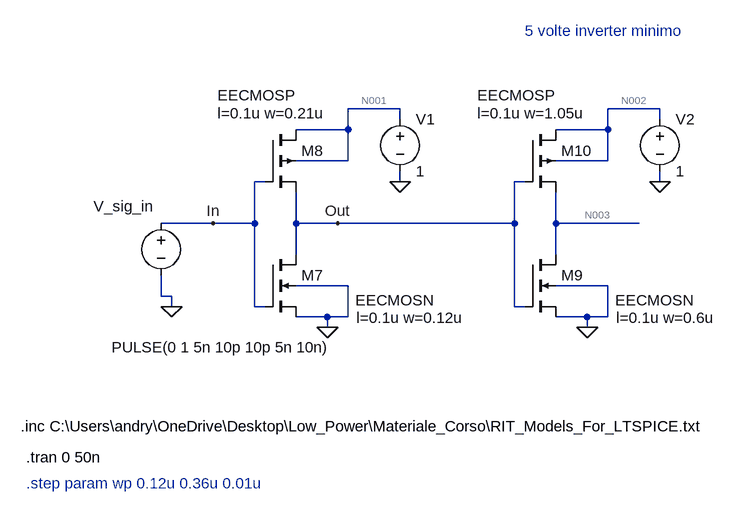
[diagram p0: schematic Esercitazione_3.asc]
Esercitazione_3.asc, the LTspice schematic file:
Version 4
SHEET 1 2808 680
WIRE 528 -96 448 -96
WIRE 928 -96 848 -96
WIRE 528 -80 528 -96
WIRE 928 -80 928 -96
WIRE 448 -64 448 -96
WIRE 448 -64 368 -64
WIRE 848 -64 848 -96
WIRE 848 -64 768 -64
WIRE 448 -16 448 -64
WIRE 448 -16 368 -16
WIRE 848 -16 848 -64
WIRE 848 -16 768 -16
WIRE 320 16 304 16
WIRE 528 16 528 0
WIRE 720 16 704 16
WIRE 928 16 928 0
WIRE 240 80 160 80
WIRE 304 80 304 16
WIRE 304 80 240 80
WIRE 368 80 368 32
WIRE 432 80 368 80
WIRE 704 80 704 16
WIRE 704 80 432 80
WIRE 768 80 768 32
WIRE 896 80 768 80
WIRE 368 128 368 80
WIRE 768 128 768 80
WIRE 448 176 368 176
WIRE 848 176 768 176
WIRE 160 192 160 160
WIRE 176 192 160 192
WIRE 176 208 176 192
WIRE 304 208 304 80
WIRE 320 208 304 208
WIRE 704 208 704 80
WIRE 720 208 704 208
WIRE 416 224 368 224
WIRE 448 224 448 176
WIRE 448 224 416 224
WIRE 816 224 768 224
WIRE 848 224 848 176
WIRE 848 224 816 224
WIRE 416 240 416 224
WIRE 816 240 816 224
FLAG 416 240 0
FLAG 528 16 0
FLAG 176 208 0
FLAG 432 80 Out
FLAG 240 80 In
FLAG 816 240 0
FLAG 928 16 0
SYMBOL nmos4 320 128 R0
WINDOW 3 139 70 Left 2
WINDOW 123 141 97 Left 2
SYMATTR Value EECMOSN
SYMATTR Value2 l=0.1u w=0.12u
SYMATTR InstName M7
SYMBOL pmos4 320 -64 R0
WINDOW 3 -73 -53 Left 2
WINDOW 123 -73 -25 Left 2
SYMATTR Value EECMOSP
SYMATTR Value2 l=0.1u w=0.21u
SYMATTR InstName M8
SYMBOL voltage 160 64 R0
WINDOW 3 -76 207 Left 2
WINDOW 123 0 0 Left 0
WINDOW 39 0 0 Left 0
WINDOW 0 -104 -10 Left 2
SYMATTR Value PULSE(0 1 5n 10p 10p 5n 10n)
SYMATTR InstName V_sig_in
SYMBOL voltage 528 -96 R0
WINDOW 123 0 0 Left 0
WINDOW 39 0 0 Left 0
SYMATTR InstName V1
SYMATTR Value 1
SYMBOL nmos4 720 128 R0
WINDOW 3 139 70 Left 2
WINDOW 123 141 97 Left 2
SYMATTR Value EECMOSN
SYMATTR Value2 l=0.1u w=0.6u
SYMATTR InstName M9
SYMBOL pmos4 720 -64 R0
WINDOW 3 -73 -53 Left 2
WINDOW 123 -73 -25 Left 2
SYMATTR Value EECMOSP
SYMATTR Value2 l=0.1u w=1.05u
SYMATTR InstName M10
SYMBOL voltage 928 -96 R0
WINDOW 123 0 0 Left 0
WINDOW 39 0 0 Left 0
SYMATTR InstName V2
SYMATTR Value 1
TEXT -56 392 Left 2 !.inc C:\\Users\\andry\\OneDrive\\Desktop\\Low_Power\\Materiale_Corso\\RIT_Models_For_LTSPICE.txt
TEXT -48 440 Left 2 !.tran 0 50n
TEXT -48 480 Left 2 ;.step param wp 0.12u 0.36u 0.01u
TEXT 720 -216 Left 2 ;5 volte inverter minimo

The netlist it stands for:
* Esercitazione_3.asc
M7 Out In 0 0 EECMOSN l=0.1u w=0.12u
M8 N001 In Out N001 EECMOSP l=0.1u w=0.21u
V_sig_in In 0 PULSE(0 1 5n 10p 10p 5n 10n)
V1 N001 0 1
M9 N003 Out 0 0 EECMOSN l=0.1u w=0.6u
M10 N002 Out N003 N002 EECMOSP l=0.1u w=1.05u
V2 N002 0 1
.model NMOS NMOS
.model PMOS PMOS
.lib standard.mos
.inc C:\Users\andry\OneDrive\Desktop\Low_Power\Materiale_Corso\RIT_Models_For_LTSPICE.txt
.tran 0 50n
* .step param wp 0.12u 0.36u 0.01u
* 5 volte inverter minimo
.backanno
.end

* Results of the author's LTspice run, read from the files saved beside the schematic
* Operating Point, zero values left out:
*   V(out) = 999.9 mV
*   V(n001) = 1 V
*   V(n003) = 143.3 µV
*   V(n002) = 1 V
*   Id(M10) = 71.39 nA
*   Ib(M10) = 1.01 pA
*   Is(M10) = -71.39 nA
*   Id(M8) = 6.593 nA
*   Is(M8) = -6.593 nA
*   Id(M9) = 71.39 nA
*   Is(M9) = -71.39 nA
*   Id(M7) = 6.593 nA
*   Ib(M7) = -1.01 pA
*   Is(M7) = -6.592 nA
*   I(V2) = -71.39 nA
*   I(V1) = -6.593 nA
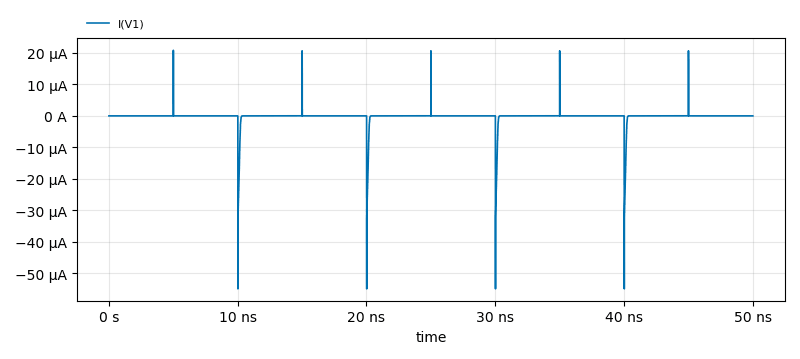
[diagram p1: Transient Analysis of Esercitazione_3.asc, plotted from the saved traces]
* Transient Analysis, 1 run:
*   I(V1): min -55 µA, max 20.83 µA, average -293.6 nA, rms 2.73 µA, last -5.411 nA